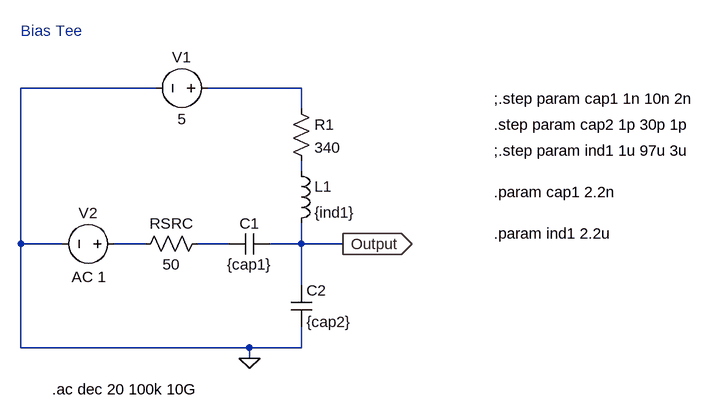
[diagram p0: schematic Bias-Tee_v2_AC.asc]
Bias-Tee_v2_AC.asc, the LTspice schematic file:
Version 4
SHEET 1 968 680
WIRE 112 0 -96 0
WIRE 336 0 192 0
WIRE 336 32 336 0
WIRE 336 128 336 112
WIRE -96 240 -96 0
WIRE -32 240 -96 240
WIRE 96 240 48 240
WIRE 224 240 176 240
WIRE 336 240 336 208
WIRE 336 240 288 240
WIRE 400 240 336 240
WIRE 336 304 336 240
WIRE -96 400 -96 240
WIRE 256 400 -96 400
WIRE 336 400 336 368
WIRE 336 400 256 400
WIRE 256 416 256 400
FLAG 256 416 0
FLAG 400 240 Output
IOPIN 400 240 Out
SYMBOL ind 320 112 R0
SYMATTR InstName L1
SYMATTR Value {ind1}
SYMBOL voltage 64 240 R90
WINDOW 0 -32 56 VBottom 2
WINDOW 3 32 56 VTop 2
WINDOW 123 35 55 VTop 2
WINDOW 39 0 0 Left 0
SYMATTR InstName V2
SYMATTR Value ""
SYMATTR Value2 AC 1
SYMBOL voltage 208 0 R90
WINDOW 0 -32 56 VBottom 2
WINDOW 3 32 56 VTop 2
WINDOW 123 0 0 Left 0
WINDOW 39 0 0 Left 0
SYMATTR InstName V1
SYMATTR Value 5
SYMBOL res 192 224 R90
WINDOW 0 0 56 VBottom 2
WINDOW 3 32 56 VTop 2
SYMATTR InstName RSRC
SYMATTR Value 50
SYMBOL cap 288 224 R90
WINDOW 0 0 32 VBottom 2
WINDOW 3 32 32 VTop 2
SYMATTR InstName C1
SYMATTR Value {cap1}
SYMBOL cap 320 304 R0
SYMATTR InstName C2
SYMATTR Value {cap2}
SYMBOL res 320 16 R0
SYMATTR InstName R1
SYMATTR Value 340
TEXT -96 -88 Left 2 ;Bias Tee
TEXT -48 464 Left 2 !.ac dec 20 100k 10G
TEXT 632 16 Left 2 !;.step param cap1 1n 10n 2n
TEXT 632 96 Left 2 !;.step param ind1 1u 97u 3u
TEXT 632 160 Left 2 !.param cap1 2.2n
TEXT 632 224 Left 2 !.param ind1 2.2u
TEXT 632 56 Left 2 !.step param cap2 1p 30p 1p

The netlist it stands for:
* Bias-Tee_v2_AC.asc
L1 N002 Output {ind1}
V2 N003 0 AC 1
V1 N001 0 5
RSRC N004 N003 50
C1 Output N004 {cap1}
C2 Output 0 {cap2}
R1 N001 N002 340
* Bias Tee
.ac dec 20 100k 10G
;.step param cap1 1n 10n 2n
;.step param ind1 1u 97u 3u
.param cap1 2.2n
.param ind1 2.2u
.step param cap2 1p 30p 1p
.backanno
.end